# EAGLE design spi-interface-T1M (EAGLE 6.5.0)
DESIGNER: JONNEW, MWL@MIT; DESIGN_NAME: spi-interface (2x64_hirose-circular); LICENSE: (c) Jon Newman CC-BY-SA-NC 4.0; REVISION: 1.2
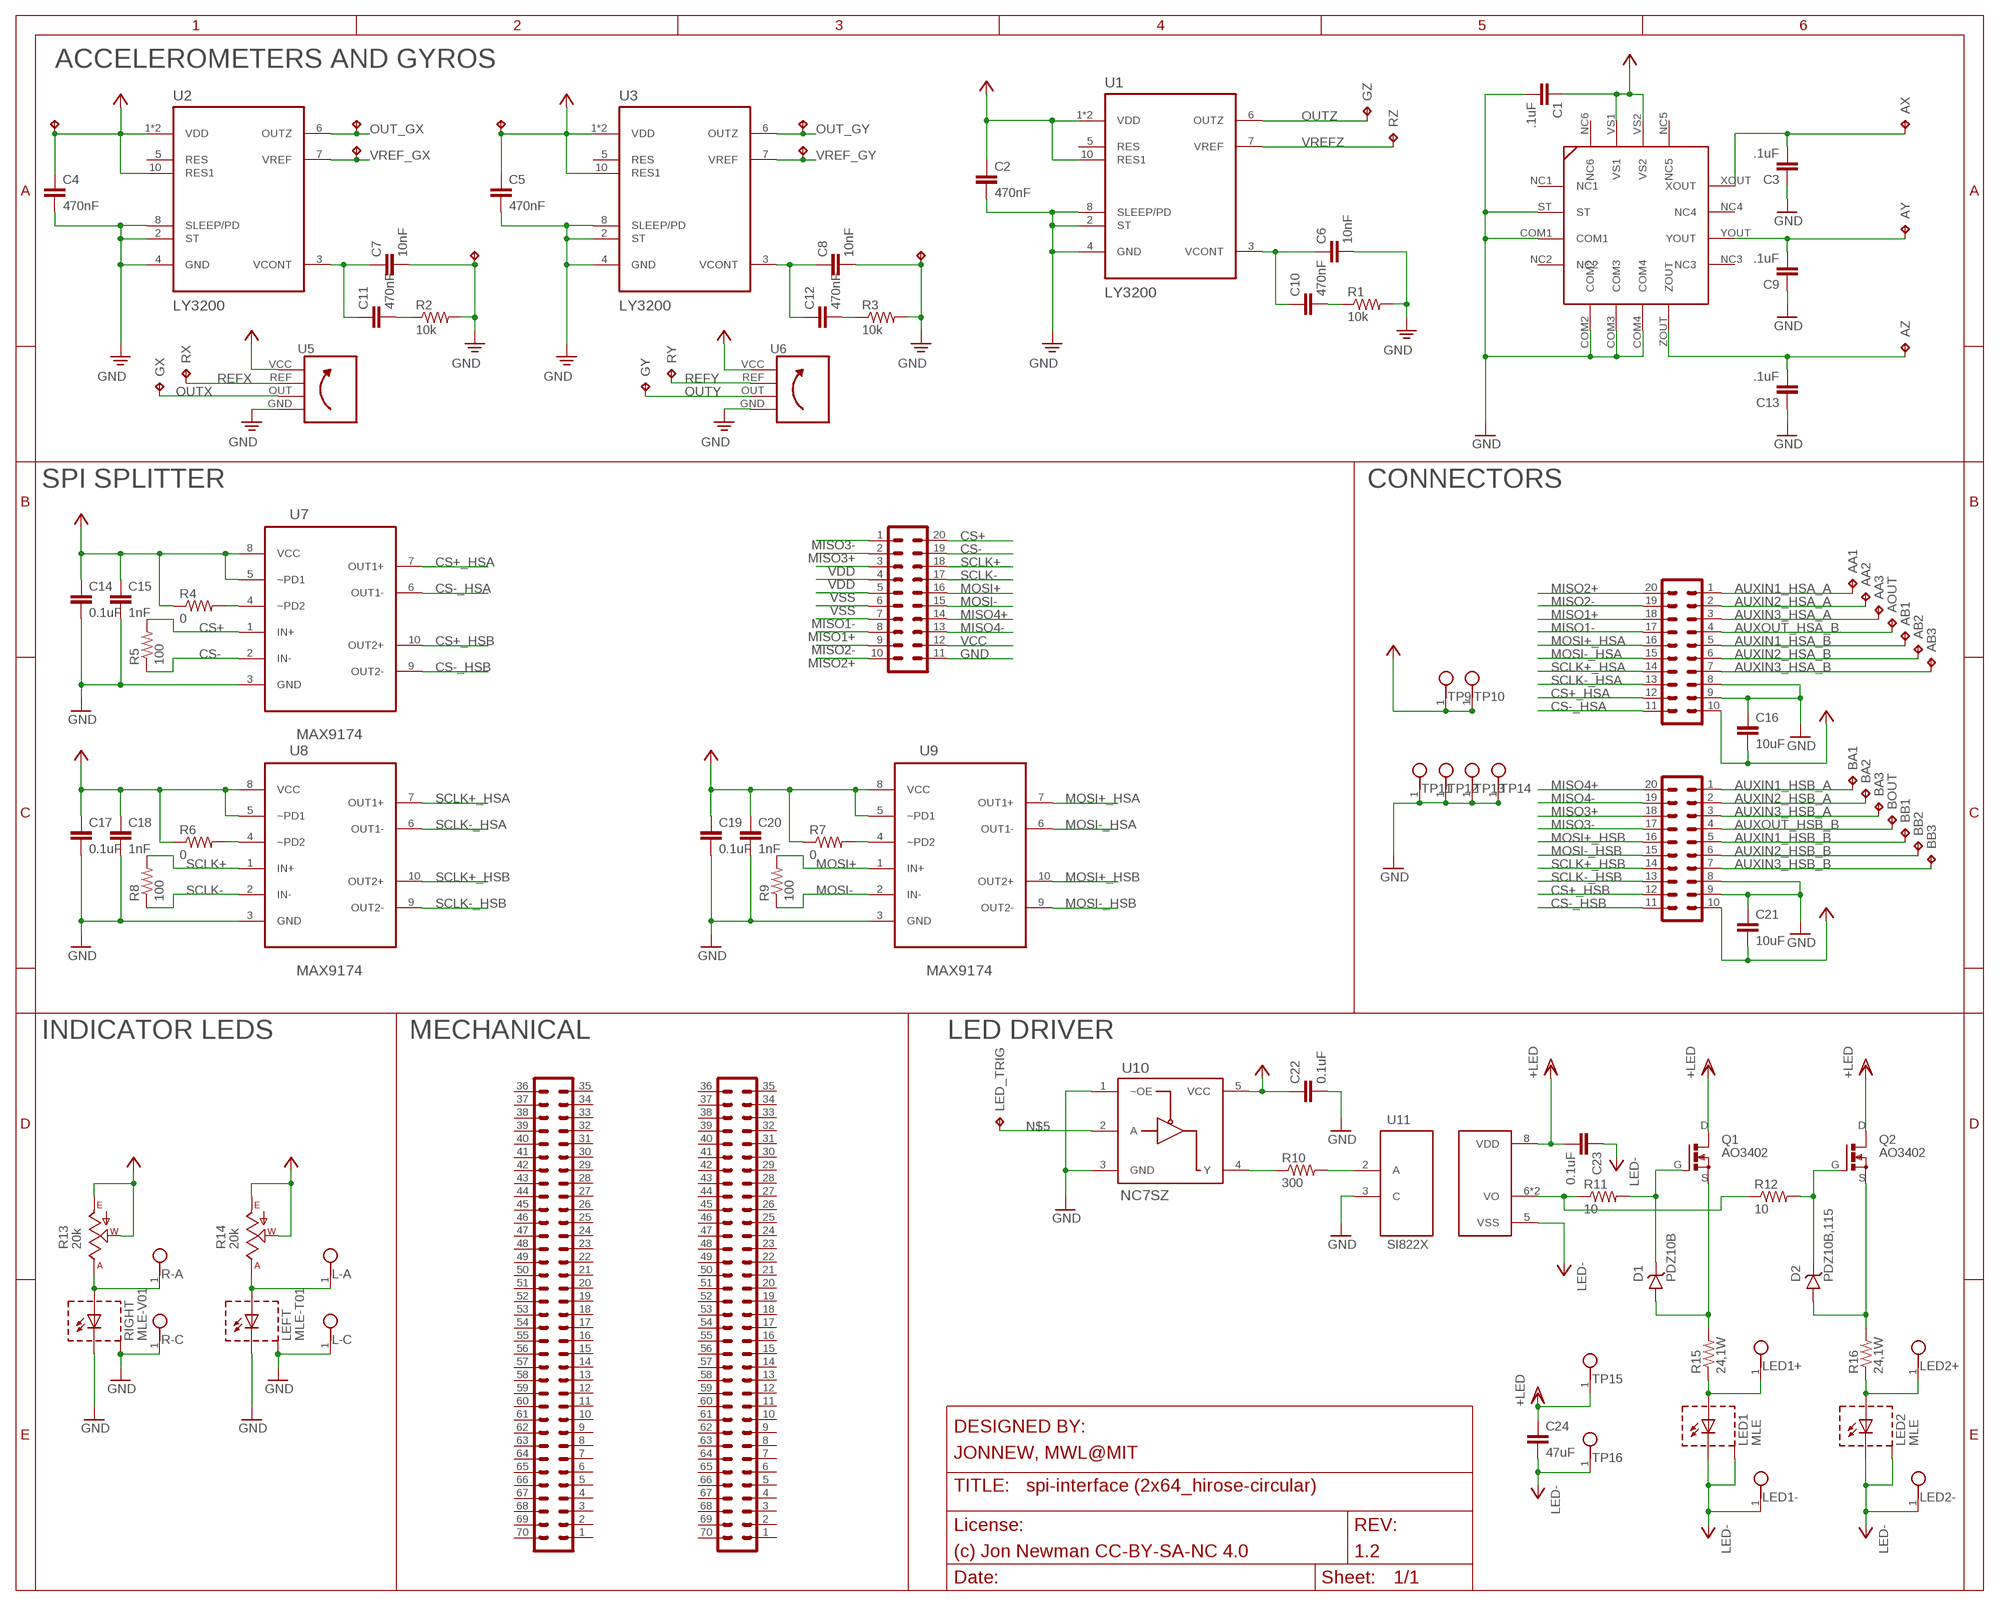
[diagram p0: schematic, sheet 1]

## Parts
AA1  TP_0.5MM  [TESTPOINT_0.5MM]
AA2  TP_0.5MM  [TESTPOINT_0.5MM]
AA3  TP_0.5MM  [TESTPOINT_0.5MM]
AB1  TP_0.5MM  [TESTPOINT_0.5MM]
AB2  TP_0.5MM  [TESTPOINT_0.5MM]
AB3  TP_0.5MM  [TESTPOINT_0.5MM]
AOUT  TP_0.5MM  [TESTPOINT_0.5MM]
AX  TP_0.5MM  [TESTPOINT_0.5MM]
AY  TP_0.5MM  [TESTPOINT_0.5MM]
AZ  TP_0.5MM  [TESTPOINT_0.5MM]
BA1  TP_0.5MM  [TESTPOINT_0.5MM]
BA2  TP_0.5MM  [TESTPOINT_0.5MM]
BA3  TP_0.5MM  [TESTPOINT_0.5MM]
BB1  TP_0.5MM  [TESTPOINT_0.5MM]
BB2  TP_0.5MM  [TESTPOINT_0.5MM]
BB3  TP_0.5MM  [TESTPOINT_0.5MM]
BOUT  TP_0.5MM  [TESTPOINT_0.5MM]
C1  .1uF  C_0402  [0402]
C2  470nF  C_0201  [0201]
C3  .1uF  C_0201  [0201]
C4  470nF  C_0201  [0201]
C5  470nF  C_0201  [0201]
C6  10nF  C_0201  [0201]
C7  10nF  C_0201  [0201]
C8  10nF  C_0201  [0201]
C9  .1uF  C_0201  [0201]
C10  470nF  C_0201  [0201]
C11  470nF  C_0201  [0201]
C12  470nF  C_0201  [0201]
C13  .1uF  C_0201  [0201]
C14  0.1uF  C_0402  [0402]
C15  1nF  C_0201  [0201]
C16  10uF  C_0805  [0805]
C17  0.1uF  C_0402  [0402]
C18  1nF  C_0201  [0201]
C19  0.1uF  C_0402  [0402]
C20  1nF  C_0201  [0201]
C21  10uF  C_0805  [0805]
C22  0.1uF  C_0402  [0402]
C23  0.1uF  C_0402  [0402]
C24  47uF  C_1206  [1206]
D1  PDZ10B  Z-DIODE_SOD-323  [SOD-323]
D2  PDZ10B,115  Z-DIODE_SOD-323  [SOD-323]
DIO_HSA  PINHD-2X10_DF40-20REC  [DF40-20REC]
DIO_HSB  PINHD-2X10_DF40-20REC  [DF40-20REC]
GX  TP_0.5MM  [TESTPOINT_0.5MM]
GY  TP_0.5MM  [TESTPOINT_0.5MM]
GZ  TP_0.5MM  [TESTPOINT_0.5MM]
L-A  TESTPOINT_SMALL  [TESTPOINT_SMALL]
L-C  TESTPOINT_SMALL  [TESTPOINT_SMALL]
LED1  MLE  LED_PKG-BODY  [LED-MLE]
LED1+  TESTPOINT_SMALL  [TESTPOINT_SMALL]
LED1-  TESTPOINT_SMALL  [TESTPOINT_SMALL]
LED2  MLE  LED_PKG-BODY  [LED-MLE]
LED2+  TESTPOINT_SMALL  [TESTPOINT_SMALL]
LED2-  TESTPOINT_SMALL  [TESTPOINT_SMALL]
LED_TRIG  TP_0.5MM  [TESTPOINT_0.5MM]
LEFT  MLE-T01  LED_PKG-BODY  [LED-MLE]
MECH_E0B  PINHD-2X35_DF40REC  [DF40-70REC]
MECH_W0B  PINHD-2X35_DF40REC  [DF40-70REC]
Q1  AO3402  N-MOSFET_SOT23-GSD  [SOT23-GSD]
Q2  AO3402  N-MOSFET_SOT23-GSD  [SOT23-GSD]
R1  10k  R_0201  [0201]
R2  10k  R_0201  [0201]
R3  10k  R_0201  [0201]
R4  0  R_0201  [0201]
R5  100  R_0201  [0201]
R6  0  R_0201  [0201]
R7  0  R_0201  [0201]
R8  100  R_0201  [0201]
R9  100  R_0201  [0201]
R10  300  R_0402  [0402]
R11  10  R_0402  [0402]
R12  10  R_0402  [0402]
R13  20k  TRIM_US-SM-42/43W  [SM-42/43W]
R14  20k  TRIM_US-SM-42/43W  [SM-42/43W]
R15  24,1W  R_0805  [0805]
R16  24,1W  R_0805  [0805]
R-A  TESTPOINT_SMALL  [TESTPOINT_SMALL]
R-C  TESTPOINT_SMALL  [TESTPOINT_SMALL]
RIGHT  MLE-V01  LED_PKG-BODY  [LED-MLE]
RX  TP_0.5MM  [TESTPOINT_0.5MM]
RY  TP_0.5MM  [TESTPOINT_0.5MM]
RZ  TP_0.5MM  [TESTPOINT_0.5MM]
TETHER  T1M-10-T-DV  PINHD-2X10_T1M  [T1M-10-T-DV]
TP1  TPTP08SQ  [TP08SQ]
TP2  TPTP08SQ  [TP08SQ]
TP3  TPTP08SQ  [TP08SQ]
TP4  TPTP08SQ  [TP08SQ]
TP5  TPTP08SQ  [TP08SQ]
TP6  TPTP08SQ  [TP08SQ]
TP7  TPTP08SQ  [TP08SQ]
TP8  TPTP08SQ  [TP08SQ]
TP9  TESTPOINT_SMALL  [TESTPOINT_SMALL]
TP10  TESTPOINT_SMALL  [TESTPOINT_SMALL]
TP11  TESTPOINT_SMALL  [TESTPOINT_SMALL]
TP12  TESTPOINT_SMALL  [TESTPOINT_SMALL]
TP13  TESTPOINT_SMALL  [TESTPOINT_SMALL]
TP14  TESTPOINT_SMALL  [TESTPOINT_SMALL]
TP15  TESTPOINT_SMALL  [TESTPOINT_SMALL]
TP16  TESTPOINT_SMALL  [TESTPOINT_SMALL]
U1  LY3200  LY3200ALH_LGA-10-COMPACT  [LGA-10-COMPACT]
U2  LY3200  LY3200ALH_LGA-10-COMPACT  [LGA-10-COMPACT]
U3  LY3200  LY3200ALH_LGA-10-COMPACT  [LGA-10-COMPACT]
U4  ADXL335  [ADXL335]
U5  LY3200-VERT-MODULE  [LY3200-VERT-MODULE]
U6  LY3200-VERT-MODULE  [LY3200-VERT-MODULE]
U7  MAX9174  MAX9174_UMAX  [10-UMAX]
U8  MAX9174  MAX9174_UMAX  [10-UMAX]
U9  MAX9174  MAX9174_UMAX  [10-UMAX]
U10  NC7SZ  NC7SZ125  [SOT-23-5]
U11  SI822X  [SOIC127P500X400-8N]

## Nets
AUXIN1_HSA_A: AA1.1(TP) DIO_HSA.1
AUXIN1_HSA_B: AB1.1(TP) DIO_HSA.5
AUXIN1_HSB_A: BA1.1(TP) DIO_HSB.1
AUXIN1_HSB_B: BB1.1(TP) DIO_HSB.5
AUXIN2_HSA_A: AA2.1(TP) DIO_HSA.2
AUXIN2_HSA_B: AB2.1(TP) DIO_HSA.6
AUXIN2_HSB_A: BA2.1(TP) DIO_HSB.2
AUXIN2_HSB_B: BB2.1(TP) DIO_HSB.6
AUXIN3_HSA_A: AA3.1(TP) DIO_HSA.3
AUXIN3_HSA_B: AB3.1(TP) DIO_HSA.7
AUXIN3_HSB_A: BA3.1(TP) DIO_HSB.3
AUXIN3_HSB_B: BB3.1(TP) DIO_HSB.7
AUXOUT_HSA_B: AOUT.1(TP) DIO_HSA.4
AUXOUT_HSB_B: BOUT.1(TP) DIO_HSB.4
CS+: R5.2 TETHER.20 U7.1(IN+)
CS+_HSA: DIO_HSA.12 U7.7(OUT1+)
CS+_HSB: DIO_HSB.12 U7.10(OUT2+)
CS-: R5.1 TETHER.19 U7.2(IN-)
CS-_HSA: DIO_HSA.11 U7.6(OUT1-)
CS-_HSB: DIO_HSB.11 U7.9(OUT2-)
GND: C1.2 C2.2 C3.1 C4.2 C5.2 C6.2 C7.2 C8.2 C9.1 C13.1 C14.2 C15.2 C16.1 C17.2 C18.2 C19.2 C20.2 C21.1 C22.2 DIO_HSA.8 DIO_HSA.9 DIO_HSB.8 DIO_HSB.9 L-C.1 LEFT.C1(C) LEFT.C2(C) LEFT.HS(BODY) R1.2 R2.2 R3.2 R-C.1 RIGHT.C1(C) RIGHT.C2(C) RIGHT.HS(BODY) TETHER.11 TP7.TP TP8.TP TP11.1 TP12.1 TP13.1 TP14.1 U1.2(ST) U1.4(GND) U1.8(SLEEP/PD) U2.2(ST) U2.4(GND) U2.8(SLEEP/PD) U3.2(ST) U3.4(GND) U3.8(SLEEP/PD) U4.COM1 U4.COM2 U4.COM3 U4.COM4 U4.ST U5.GND U6.GND U7.3(GND) U8.3(GND) U9.3(GND) U10.1(~OE) U10.3(GND) U11.3(C)
MISO1+: DIO_HSA.18 TETHER.8
MISO1-: DIO_HSA.17 TETHER.7
MISO2+: DIO_HSA.20 TETHER.10
MISO2-: DIO_HSA.19 TETHER.9
MISO3+: DIO_HSB.18 TETHER.2
MISO3-: DIO_HSB.17 TETHER.1
MISO4+: DIO_HSB.20 TETHER.14
MISO4-: DIO_HSB.19 TETHER.13
MOSI+: R9.2 TETHER.16 U9.1(IN+)
MOSI+_HSA: DIO_HSA.16 U9.7(OUT1+)
MOSI+_HSB: DIO_HSB.16 U9.10(OUT2+)
MOSI-: R9.1 TETHER.15 U9.2(IN-)
MOSI-_HSA: DIO_HSA.15 U9.6(OUT1-)
MOSI-_HSB: DIO_HSB.15 U9.9(OUT2-)
N$1: R10.2 U11.2(A)
N$2: C7.1 C11.1 U2.3(VCONT)
N$3: LED1+.1 LED1.A1(A) LED1.A2(A) R15.1
N$4: D1.A Q1.S R15.2
N$5: LED_TRIG.1(TP) U10.2(A)
N$6: R10.1 U10.4(Y)
N$7: D2.C Q2.G R12.2
N$8: C11.2 R2.1
N$9: R13.1(A) R-A.1 RIGHT.A1(A) RIGHT.A2(A)
N$10: C8.1 C12.1 U3.3(VCONT)
N$11: D2.A Q2.S R16.2
N$12: LED2+.1 LED2.A1(A) LED2.A2(A) R16.1
N$13: L-A.1 LEFT.A1(A) LEFT.A2(A) R14.1(A)
N$14: C12.2 R3.1
N$15: C6.1 C10.1 U1.3(VCONT)
N$16: C10.2 R1.1
N$17: R4.2 U7.4(~PD2)
N$18: R7.2 U9.4(~PD2)
N$19: R6.2 U8.4(~PD2)
N$20: D1.C Q1.G R11.2
N$22: R11.1 R12.1 U11.6(VO) U11.7(VO)
OUT_GX: TP2.TP U2.6(OUTZ)
OUT_GY: TP4.TP U3.6(OUTZ)
OUTX: GX.1(TP) U5.OUT
OUTY: GY.1(TP) U6.OUT
OUTZ: GZ.1(TP) U1.6(OUTZ)
REFX: RX.1(TP) U5.REF
REFY: RY.1(TP) U6.REF
SCLK+: R8.2 TETHER.18 U8.1(IN+)
SCLK+_HSA: DIO_HSA.14 U8.7(OUT1+)
SCLK+_HSB: DIO_HSB.14 U8.10(OUT2+)
SCLK-: R8.1 TETHER.17 U8.2(IN-)
SCLK-_HSA: DIO_HSA.13 U8.6(OUT1-)
SCLK-_HSB: DIO_HSB.13 U8.9(OUT2-)
VCC: C1.1 C2.1 C4.1 C5.1 C14.1 C15.1 C16.2 C17.1 C18.1 C19.1 C20.1 C21.2 C22.1 DIO_HSA.10 DIO_HSB.10 R4.1 R6.1 R7.1 R13.2(W) R13.3(E) R14.2(W) R14.3(E) TETHER.12 TP1.TP TP3.TP TP9.1 TP10.1 U1.1(VDD) U1.9(VDD) U1.10(RES1) U2.1(VDD) U2.9(VDD) U2.10(RES1) U3.1(VDD) U3.9(VDD) U3.10(RES1) U4.VS1 U4.VS2 U5.VCC U6.VCC U7.5(~PD1) U7.8(VCC) U8.5(~PD1) U8.8(VCC) U9.5(~PD1) U9.8(VCC) U10.5(VCC)
VDD: C23.2 C24.1 Q1.D Q2.D TETHER.3 TETHER.4 TP15.1 U11.8(VDD) ; supply symbol labelled +LED
VREF_GX: TP5.TP U2.7(VREF)
VREF_GY: TP6.TP U3.7(VREF)
VREFZ: RZ.1(TP) U1.7(VREF)
VSS: C23.1 C24.2 LED1-.1 LED1.C1(C) LED1.C2(C) LED1.HS(BODY) LED2-.1 LED2.C1(C) LED2.C2(C) LED2.HS(BODY) TETHER.5 TETHER.6 TP16.1 U11.5(VSS) ; supply symbol labelled LED-
XOUT1: AX.1(TP) C3.2 U4.XOUT
YOUT1: AY.1(TP) C9.2 U4.YOUT
ZOUT1: AZ.1(TP) C13.2 U4.ZOUT
Unconnected: MECH_E0B.1 MECH_E0B.2 MECH_E0B.3 MECH_E0B.4 MECH_E0B.5 MECH_E0B.6 MECH_E0B.7 MECH_E0B.8 MECH_E0B.9 MECH_E0B.10 MECH_E0B.11 MECH_E0B.12 MECH_E0B.13 MECH_E0B.14 MECH_E0B.15 MECH_E0B.16 MECH_E0B.17 MECH_E0B.18 MECH_E0B.19 MECH_E0B.20 MECH_E0B.21 MECH_E0B.22 MECH_E0B.23 MECH_E0B.24 MECH_E0B.25 MECH_E0B.26 MECH_E0B.27 MECH_E0B.28 MECH_E0B.29 MECH_E0B.30 MECH_E0B.31 MECH_E0B.32 MECH_E0B.33 MECH_E0B.34 MECH_E0B.35 MECH_E0B.36 MECH_E0B.37 MECH_E0B.38 MECH_E0B.39 MECH_E0B.40 MECH_E0B.41 MECH_E0B.42 MECH_E0B.43 MECH_E0B.44 MECH_E0B.45 MECH_E0B.46 MECH_E0B.47 MECH_E0B.48 MECH_E0B.49 MECH_E0B.50 MECH_E0B.51 MECH_E0B.52 MECH_E0B.53 MECH_E0B.54 MECH_E0B.55 MECH_E0B.56 MECH_E0B.57 MECH_E0B.58 MECH_E0B.59 MECH_E0B.60 MECH_E0B.61 MECH_E0B.62 MECH_E0B.63 MECH_E0B.64 MECH_E0B.65 MECH_E0B.66 MECH_E0B.67 MECH_E0B.68 MECH_E0B.69 MECH_E0B.70 MECH_W0B.1 MECH_W0B.2 MECH_W0B.3 MECH_W0B.4 MECH_W0B.5 MECH_W0B.6 MECH_W0B.7 MECH_W0B.8 MECH_W0B.9 MECH_W0B.10 MECH_W0B.11 MECH_W0B.12 MECH_W0B.13 MECH_W0B.14 MECH_W0B.15 MECH_W0B.16 MECH_W0B.17 MECH_W0B.18 MECH_W0B.19 MECH_W0B.20 MECH_W0B.21 MECH_W0B.22 MECH_W0B.23 MECH_W0B.24 MECH_W0B.25 MECH_W0B.26 MECH_W0B.27 MECH_W0B.28 MECH_W0B.29 MECH_W0B.30 MECH_W0B.31 MECH_W0B.32 MECH_W0B.33 MECH_W0B.34 MECH_W0B.35 MECH_W0B.36 MECH_W0B.37 MECH_W0B.38 MECH_W0B.39 MECH_W0B.40 MECH_W0B.41 MECH_W0B.42 MECH_W0B.43 MECH_W0B.44 MECH_W0B.45 MECH_W0B.46 MECH_W0B.47 MECH_W0B.48 MECH_W0B.49 MECH_W0B.50 MECH_W0B.51 MECH_W0B.52 MECH_W0B.53 MECH_W0B.54 MECH_W0B.55 MECH_W0B.56 MECH_W0B.57 MECH_W0B.58 MECH_W0B.59 MECH_W0B.60 MECH_W0B.61 MECH_W0B.62 MECH_W0B.63 MECH_W0B.64 MECH_W0B.65 MECH_W0B.66 MECH_W0B.67 MECH_W0B.68 MECH_W0B.69 MECH_W0B.70 U1.5(RES) U2.5(RES) U3.5(RES) U4.NC1 U4.NC2 U4.NC3 U4.NC4 U4.NC5 U4.NC6

## Notes on the sheet
- ACCELEROMETERS AND GYROS
- SPI SPLITTER | CONNECTORS
- INDICATOR LEDS | MECHANICAL | LED DRIVER

## Library data of the parts
AA1-AA3 AB1-AB3 AOUT AX AY AZ BA1-BA3 BB1-BB3 BOUT GX GY GZ LED_TRIG RX RY RZ TP1-TP8 = jonnew:TP: Test pad
C1 = headstage:C: Capacitor
C2-C15 C17-C20 C22-C24 = jonnew:C: Capacitor
C16 C21 = headstage:C: Capacitor; MN: TDK Corp.; PARTNO: C2012X5R1Cxxxxxxx; VID: DK
D1 D2 = jonnew:Z-DIODE: Zener Diode
DIO_HSA DIO_HSB TETHER = jonnew:PINHD-2X10
L-A L-C LED1+ LED1- LED2+ LED2- R-A R-C TP9-TP16 = jonnew:TESTPOINT: PCB Test Point
LED1 LED2 LEFT RIGHT = jonnew:LED_PKG-BODY
MECH_E0B MECH_W0B = jonnew:PINHD-2X35
Q1 Q2 = jonnew:N-MOSFET: N-CHANNEL MOS FET SYMBOL
R1-R12 R15 R16 = jonnew:R: Resistor
R13 R14 = jonnew:TRIM_US-: POTENTIOMETER
U1-U3 = jonnew:LY3200ALH
U4 = jonnew:ADXL335: The ADXL335 is a small, thin, low power, complete 3-axis accelerometer with signal conditioned voltage outputs. The product measures acceleration with a minimum full-scale range of ±3 g. It can measure the static acceleration of gravity in tilt-sensing applications, as well as dynamic acceleration resulting from motion, shock, or vibration. The user selects the bandwidth of the accelerometer using the CX, CY, and CZ capacitors at the XOUT, YOUT, and ZOUT pins. Bandwidths can be selected to suit the application, with a range of 0.5 Hz to 1600 Hz for the X and Y axes, and a range of 0.5 Hz to 550 Hz for the Z axi
U5 U6 = jonnew:LY3200-VERT-MODULE
U7-U9 = jonnew:MAX9174
U10 = jonnew:NC7SZ125
U11 = jonnew:SI822X

## Net classes
1 thick: width 0.102 mm

## Board
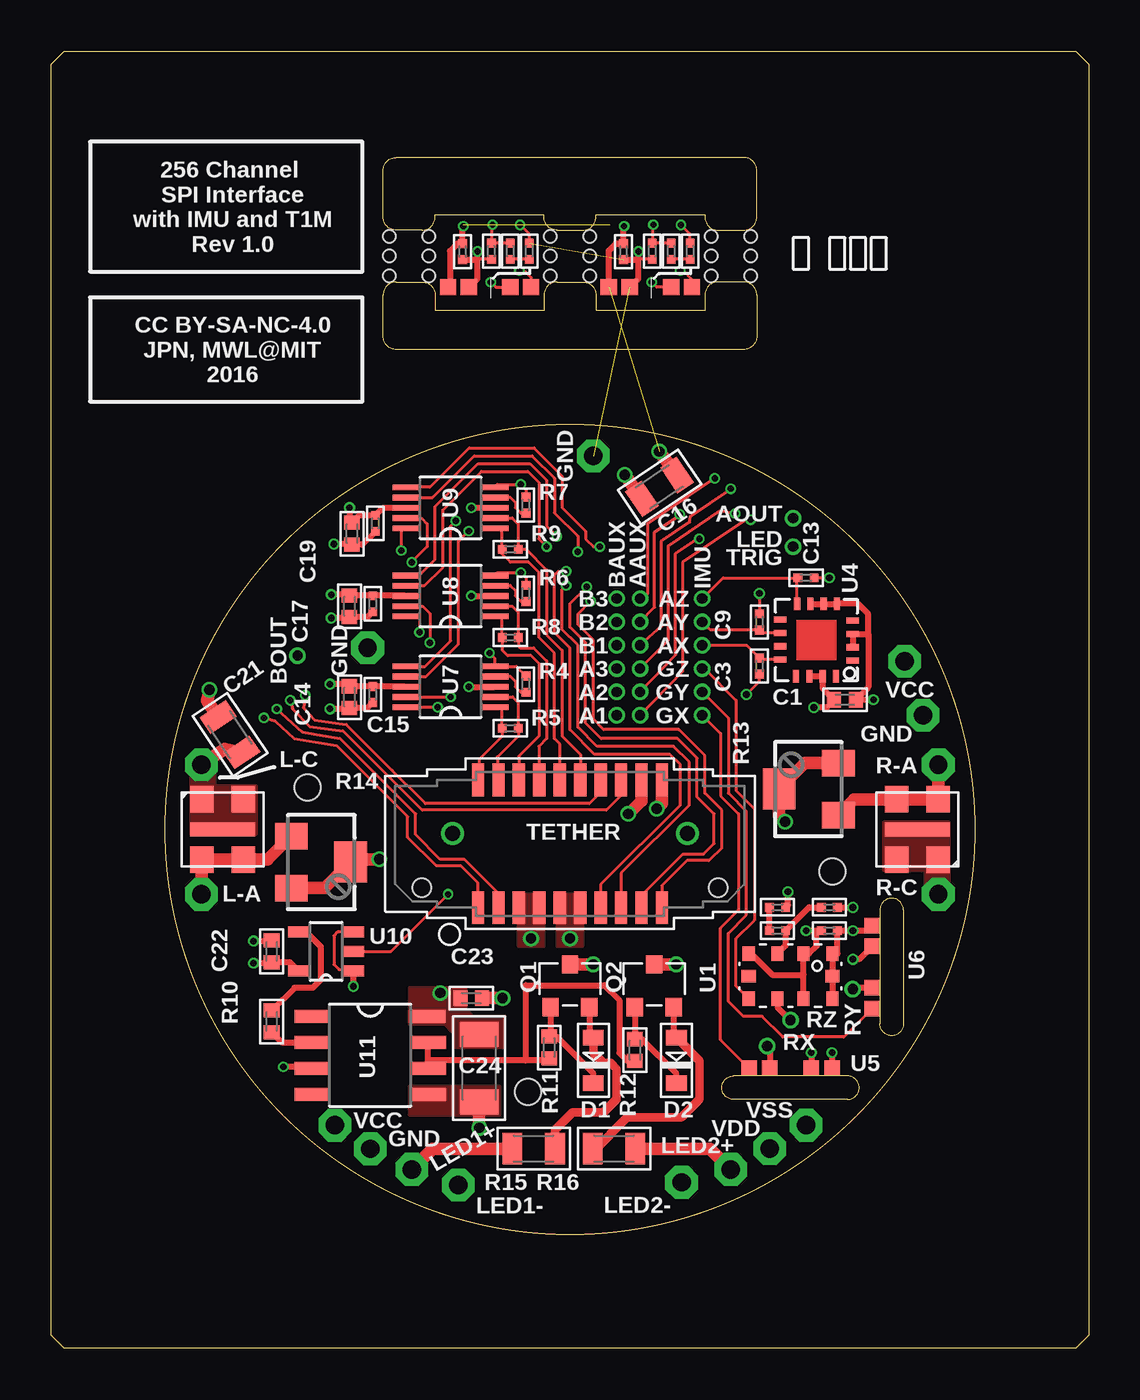
[diagram p1: board, top side]
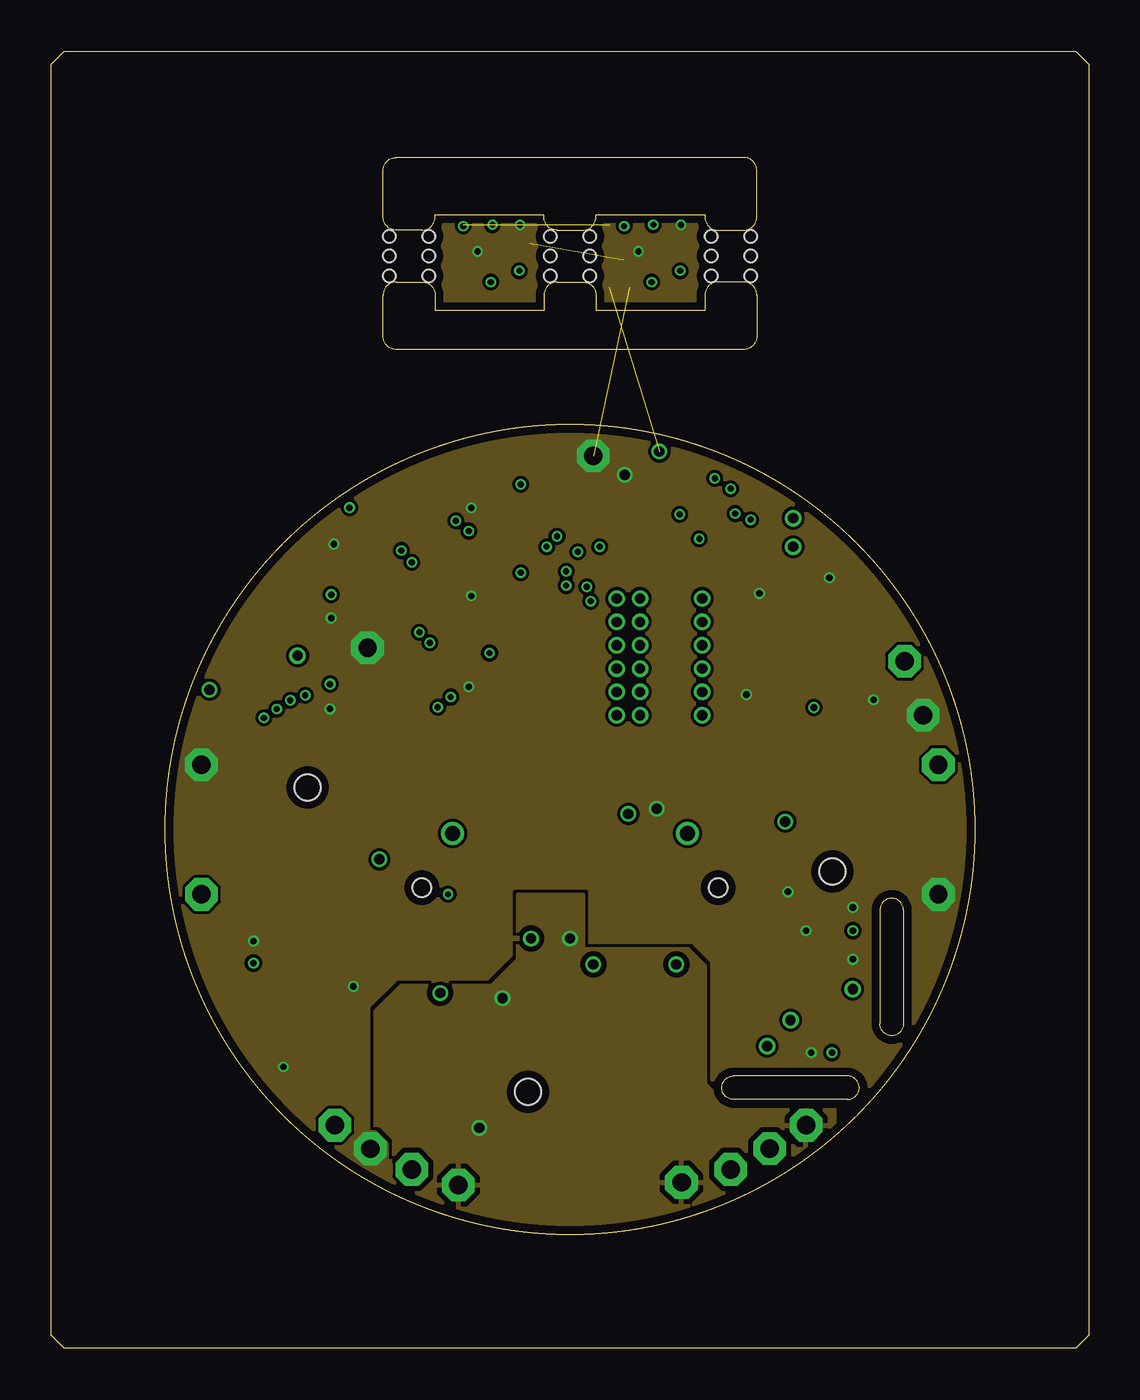
[diagram p2: board, inner layer Route2]
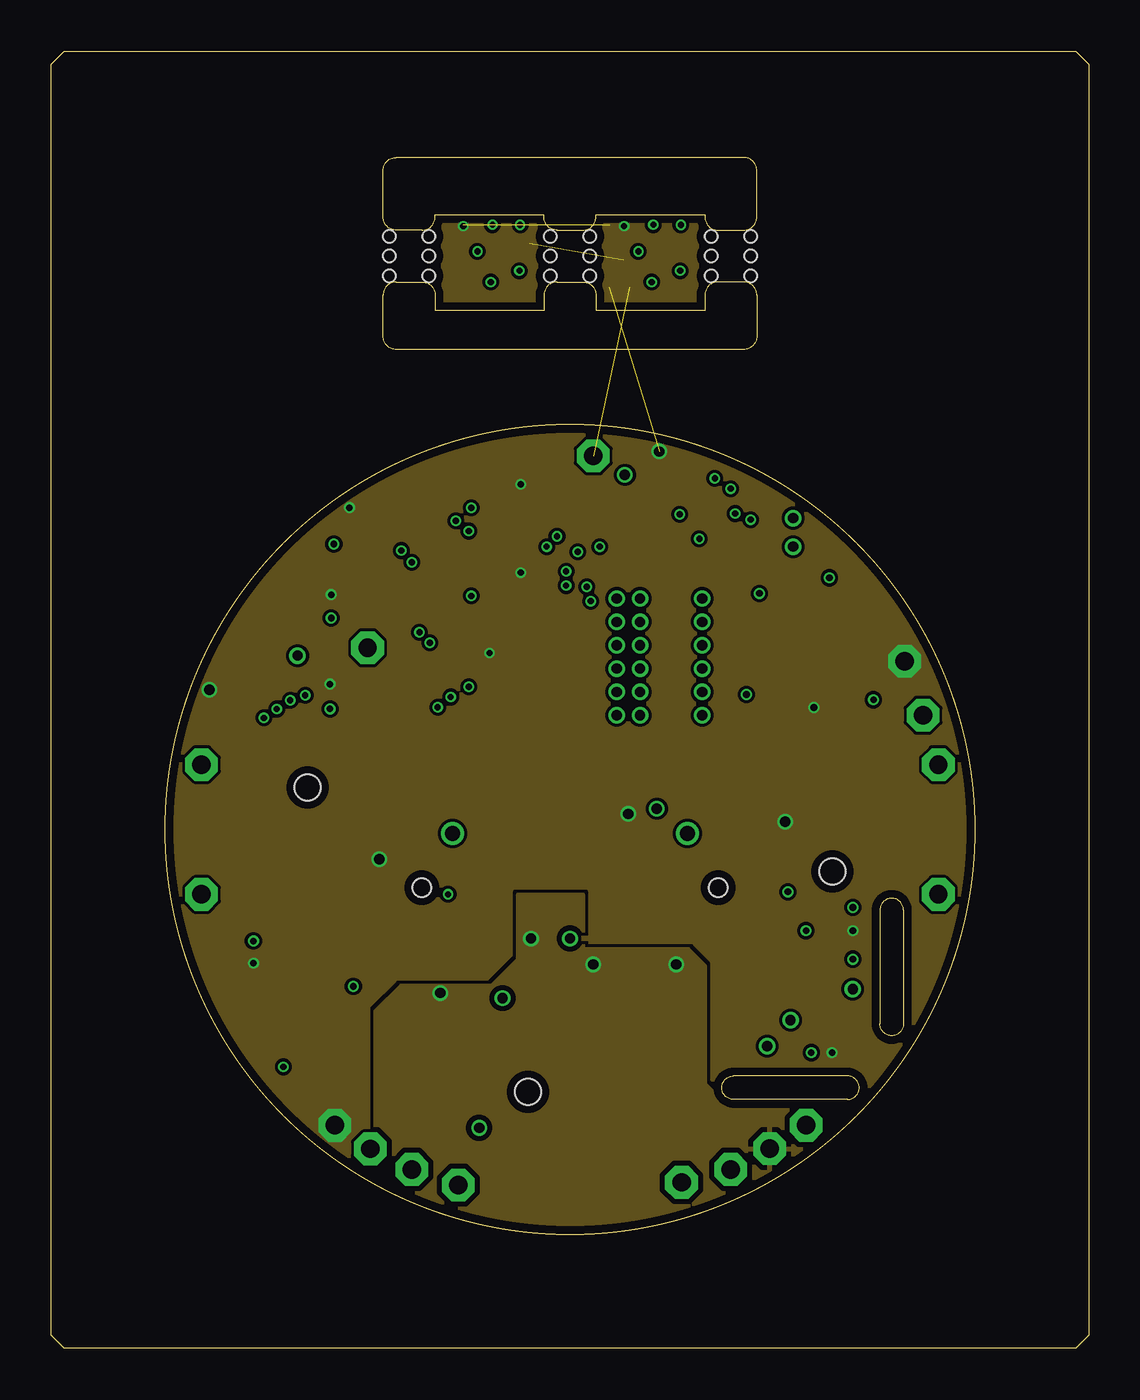
[diagram p3: board, inner layer Route15]
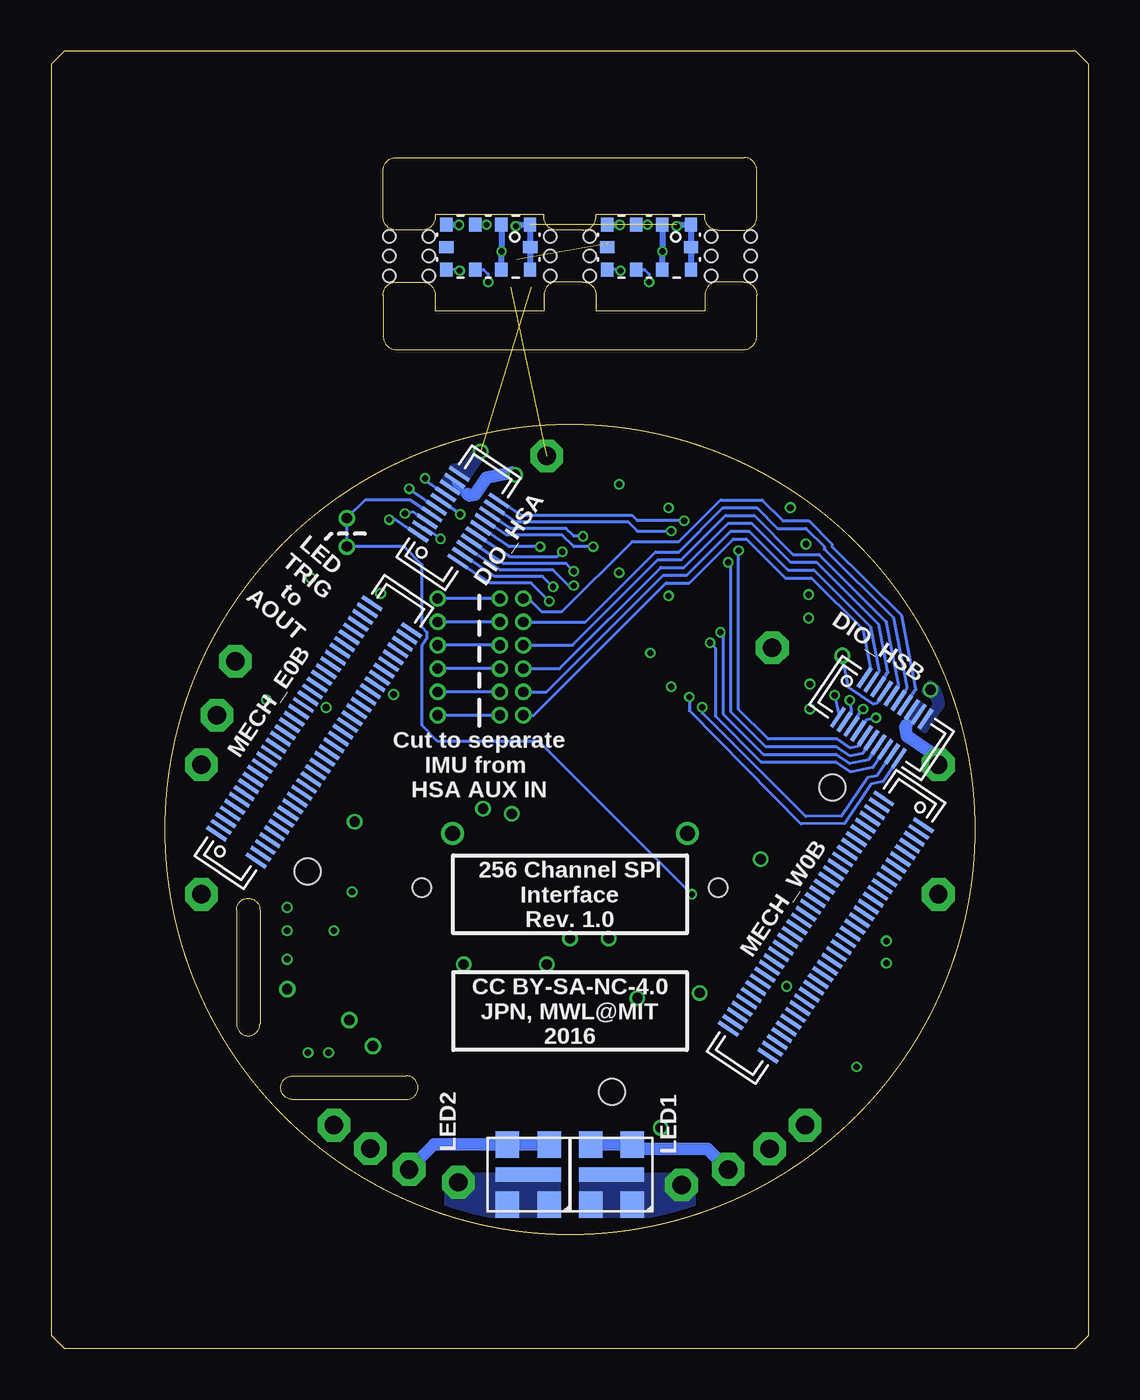
[diagram p4: board, bottom side, seen from below]

Size 50.8 x 63.5 mm. Coordinates in mm from the lower left corner, seen from the top.
Outline: 16.89,52.2 18.16,52.2 arc-90 18.8,51.56 18.8,50.8 24.13,50.8 24.13,51.56 arc-90 24.76,52.2 26.04,52.2 arc-90 26.67,51.56 26.67,50.8 32,50.8 32,51.56 arc-90 32.64,52.2 33.91,52.2 arc-90 34.54,51.56 34.54,49.53 arc-90 33.91,48.89 16.89,48.89 arc-90 16.26,49.53 16.26,51.56 arc-90 16.89,52.2
Outline: 18.16,54.74 16.89,54.74 arc-90 16.26,55.37 16.26,57.66 arc-90 16.89,58.29 33.91,58.29 arc-90 34.54,57.66 34.54,55.37 arc-90 33.91,54.74 32.64,54.74 arc-90 32,55.37 32,55.5 26.67,55.5 26.67,55.37 arc-90 26.04,54.74 24.76,54.74 arc-90 24.13,55.37 24.13,55.5 18.8,55.5 18.8,55.37 arc-90 18.16,54.74
Outline: 50.16,0 0.63,0 0,0.63 0,62.87 0.63,63.5 50.16,63.5 50.8,62.87 50.8,0.63 50.16,0
Outline: circle at 25.4,25.4 radius 19.81
Copper layers (1*2*15*16): Top 0.035mm / dielectric 0.2mm / Route2 0.0175mm / dielectric 0.3mm / Route15 0.0175mm / dielectric 0.2mm / Bottom 0.035mm
Design rules "seeed-studio-4-layer": minimum track width 6mil, minimum drill 0.3mm, track to track 6mil, track to pad 6mil, pad to pad 6mil, via to via 6mil, smd to smd 0mil, copper to edge 0.4mm, drill to drill 10mil, minimum pad ring 6mil, minimum via ring 4mil, stop-mask expansion 4mil, vias tented up to drill 100mil, thermal gap 10mil
Holes 1.27 mm at 38.25,23.34 23.34,12.55 12.55,27.46
Holes 0.6 mm at 18.49,54.43 18.49,53.47 18.49,52.5 16.56,54.43 16.56,53.47 16.56,52.5 26.37,54.43 26.37,53.47 26.37,52.5 24.43,54.43 24.43,53.47 24.43,52.5 34.24,54.43 34.24,53.47 34.24,52.5 32.31,54.43 32.31,53.47 32.31,52.5

### Footprints (pad centres in the part's own frame; a part is rotated, then mirrored left to right if it is on the bottom)
TESTPOINT_0.5MM = drill 0.5: 1 0,0
0402 = smd 0.686 x 0.762: 1 -0.533,0; 2 0.533,0
0201 = smd 0.432 x 0.432: 1 -0.394,0; 2 0.394,0
0805 = smd 0.965 x 1.524: 1 -1.041,0; 2 1.041,0
1206 = smd 1.219 x 1.88: 1 -1.651,0; 2 1.651,0
SOD-323 = smd 0.762 x 1.016: A -1.118,0; C 1.118,0
DF40-20REC = smd 0.2 x 1.14: 1 -1.8,1.17; 2 -1.4,1.17; 3 -1,1.17; 4 -0.6,1.17; 5 -0.2,1.17; 6 0.2,1.17; 7 0.6,1.17; 8 1,1.17; 9 1.4,1.17; 10 1.8,1.17; 11 1.8,-1.17; 12 1.4,-1.17; 13 1,-1.17; 14 0.6,-1.17; 15 0.2,-1.17; 16 -0.2,-1.17; 17 -0.6,-1.17; 18 -1,-1.17; 19 -1.4,-1.17; 20 -1.8,-1.17
TESTPOINT_SMALL = drill 0.9 pad 1.6 octagon: 1 0,0
LED-MLE = smd 1.3 x 1.15: A1 -1.475,1.025; A2 -1.475,-1.025; C1 1.475,1.025; C2 1.475,-1.025 | smd 0.7 x 3.2: HS 0,0
DF40-70REC = smd 0.2 x 1.14: 1 -6.8,1.17; 2 -6.4,1.17; 3 -6,1.17; 4 -5.6,1.17; 5 -5.2,1.17; 6 -4.8,1.17; 7 -4.4,1.17; 8 -4,1.17; 9 -3.6,1.17; 10 -3.2,1.17; 11 -2.8,1.17; 12 -2.4,1.17; 13 -2,1.17; 14 -1.6,1.17; 15 -1.2,1.17; 16 -0.8,1.17; 17 -0.4,1.17; 18 0,1.17; 19 0.4,1.17; 20 0.8,1.17; 21 1.2,1.17; 22 1.6,1.17; 23 2,1.17; 24 2.4,1.17; 25 2.8,1.17; 26 3.2,1.17; 27 3.6,1.17; 28 4,1.17; 29 4.4,1.17; 30 4.8,1.17; 31 5.2,1.17; 32 5.6,1.17; 33 6,1.17; 34 6.4,1.17; 35 6.8,1.17; 36 6.8,-1.17; 37 6.4,-1.17; 38 6,-1.17; 39 5.6,-1.17; 40 5.2,-1.17; 41 4.8,-1.17; 42 4.4,-1.17; 43 4,-1.17; 44 3.6,-1.17; 45 3.2,-1.17; 46 2.8,-1.17; 47 2.4,-1.17; 48 2,-1.17; 49 1.6,-1.17; 50 1.2,-1.17; 51 0.8,-1.17; 52 0.4,-1.17; 53 0,-1.17; 54 -0.4,-1.17; 55 -0.8,-1.17; 56 -1.2,-1.17; 57 -1.6,-1.17; 58 -2,-1.17; 59 -2.4,-1.17; 60 -2.8,-1.17; 61 -3.2,-1.17; 62 -3.6,-1.17; 63 -4,-1.17; 64 -4.4,-1.17; 65 -4.8,-1.17; 66 -5.2,-1.17; 67 -5.6,-1.17; 68 -6,-1.17; 69 -6.4,-1.17; 70 -6.8,-1.17
SOT23-GSD = smd 0.8 x 0.9: D 0,0; G -0.95,-2.1; S 0.95,-2.1
SM-42/43W = smd 1.3 x 1.6: 1 -1.27,-1.45; 3 1.27,-1.45 | smd 2 x 1.6: 2 0,1.45
T1M-10-T-DV = smd 0.6 x 1.6: 1 -4.5,-4.395; 2 -3.5,-4.395; 3 -2.5,-4.395; 4 -1.5,-4.395; 5 -0.5,-4.395; 6 0.5,-4.395; 7 1.5,-4.395; 8 2.5,-4.395; 9 3.5,-4.395; 10 4.5,-4.395; 11 4.5,1.855; 12 3.5,1.855; 13 2.5,1.855; 14 1.5,1.855; 15 0.5,1.855; 16 -0.5,1.855; 17 -1.5,1.855; 18 -2.5,1.855; 19 -3.5,1.855; 20 -4.5,1.855 | drill 0.74: G1 -5.75,-0.77; G2 5.75,-0.77 | hole 0.89: -7.25,-3.42; 7.25,-3.42
TP08SQ = smd 0.8 x 0.8: TP 0,0
LGA-10-COMPACT = smd 0.6 x 0.7: 1 2.05,1.1; 2 0.635,1.1; 3 -0.635,1.1; 4 -2.05,1.1; 6 -2.05,-1.1; 7 -0.635,-1.1; 8 0.635,-1.1; 9 2.05,-1.1 | smd 0.7 x 0.6: 5 -2.05,0; 10 2.05,0
ADXL335 = smd 0.61 x 0.305: COM1 -1.775,-0.3; NC1 -1.775,1; NC2 -1.775,-0.95; NC3 1.775,-1; NC4 1.775,0.3; ST -1.775,0.35; XOUT 1.775,0.95; YOUT 1.775,-0.35 | smd 0.305 x 0.61: COM2 -1,-1.775; COM3 -0.35,-1.775; COM4 0.3,-1.775; NC5 1,1.775; NC6 -0.95,1.775; VS1 0.35,1.775; VS2 -0.3,1.775; ZOUT 0.95,-1.775
LY3200-VERT-MODULE = smd 0.762 x 0.762: GND 0.381,-1.016; OUT 0.381,2.032; REF 0.381,1.016; VCC 0.381,-2.032
10-UMAX = smd 1.4 x 0.28: 1 -2.14,1; 2 -2.14,0.5; 3 -2.14,0; 4 -2.14,-0.5; 5 -2.14,-1; 6 2.14,-1; 7 2.14,-0.5; 8 2.14,0; 9 2.14,0.5; 10 2.14,1
SOT-23-5 = smd 0.55 x 1: 1 -0.95,-1.35; 2 0,-1.35; 3 0.95,-1.35; 4 0.95,1.35; 5 -0.95,1.35
SOIC127P500X400-8N = smd 1.778 x 0.635: 1 -2.819,1.905; 2 -2.819,0.635; 3 -2.819,-0.635; 4 -2.819,-1.905; 5 2.819,-1.905; 6 2.819,-0.635; 7 2.819,0.635; 8 2.794,1.905

### Placement (x,y rotation side)
AA1  28.83,30.99 0 top
AA2  28.83,32.13 0 top
AA3  28.83,33.27 0 top
AB1  28.83,34.42 0 top
AB2  28.83,35.56 0 top
AB3  28.83,36.7 0 top
AOUT  36.32,40.64 0 top
AX  31.88,34.42 0 top
AY  31.88,35.56 0 top
AZ  31.88,36.7 0 top
BA1  27.69,30.99 270 top
BA2  27.69,32.13 270 top
BA3  27.69,33.27 270 top
BB1  27.69,34.42 270 top
BB2  27.69,35.56 270 top
BB3  27.69,36.7 270 top
BOUT  12.07,33.91 270 top
C1  38.86,31.75 0 top
C2  38.1,20.45 180 top
C3  34.67,33.4 90 top
C4  20.14,53.68 270 top
C5  28.02,53.68 270 top
C6  38.1,21.59 0 top
C7  21.55,53.7 270 top
C8  29.43,53.7 270 top
C9  34.67,35.56 270 top
C10  35.56,20.45 180 top
C11  22.48,53.7 270 top
C12  30.36,53.7 270 top
C13  36.96,37.72 180 top
C14  14.61,31.88 270 top
C15  15.75,32 270 top
C16  29.78,42.16 34 top
C17  14.61,36.32 270 top
C18  15.75,36.45 270 top
C19  14.73,39.88 270 top
C20  15.88,40.39 270 top
C21  8.76,30.04 124 top
C22  10.8,19.43 90 top
C23  20.57,17.15 180 top
C24  20.96,13.72 270 top
D1  26.54,14.1 270 top
D2  30.61,14.1 270 top
DIO_HSA  30.85,40.66 56 bottom
DIO_HSB  10.14,30.85 326 bottom
GX  31.88,30.99 0 top
GY  31.88,32.13 0 top
GZ  31.88,33.27 0 top
L-A  7.37,22.22 0 top
L-C  7.37,28.57 0 top
LED1  23.37,8.51 270 bottom
LED1+  17.65,8.76 180 top
LED1-  19.94,8 180 top
LED2  27.43,8.51 270 bottom
LED2+  33.27,8.76 180 top
LED2-  30.86,8.13 180 top
LED_TRIG  36.32,39.24 0 top
LEFT  8.4,25.4 90 top
MECH_E0B  37.93,30.17 56 bottom
MECH_W0B  12.87,20.63 236 bottom
Q1  25.4,18.8 0 top
Q2  29.53,18.8 0 top
R1  35.56,21.59 0 top
R2  23.41,53.7 90 top
R3  31.28,53.7 90 top
R4  23.24,32.51 270 top
R5  22.48,30.35 180 top
R6  23.24,36.96 270 top
R7  23.24,41.27 270 top
R8  22.48,34.8 180 top
R9  22.48,39.12 180 top
R10  10.8,16 270 top
R11  24.38,14.73 90 top
R12  28.57,14.61 90 top
R13  37.08,27.38 90 top
R14  13.21,23.8 270 top
R15  23.62,9.78 0 top
R16  27.56,9.78 180 top
R-A  43.43,28.57 0 top
R-C  43.43,22.23 0 top
RIGHT  42.4,25.4 270 top
RX  35.05,14.8 0 top
RY  39.24,17.59 0 top
RZ  36.19,16.07 0 top
TETHER  25.4,25.97 0 top
TP1  19.43,51.94 0 top
TP2  23.5,51.94 0 top
TP3  27.3,51.94 0 top
TP4  31.37,51.94 0 top
TP5  22.48,51.94 0 top
TP6  30.35,51.94 0 top
TP7  20.45,51.94 0 top
TP8  28.32,51.94 0 top
TP9  13.89,10.92 0 top
TP10  41.78,33.64 0 top
TP11  15.62,9.77 0 top
TP12  42.68,30.99 0 top
TP13  26.54,43.69 0 top
TP14  15.49,34.29 0 top
TP15  35.18,9.78 0 top
TP16  36.96,10.92 0 top
U1  36.19,18.22 0 top
U2  21.53,53.9 0 bottom
U3  29.4,53.9 0 bottom
U4  37.46,34.67 180 top
U5  36.19,13.34 90 top
U6  40.58,18.67 180 top
U7  19.56,32.38 180 top
U8  19.56,36.83 180 top
U9  19.56,41.15 180 top
U10  13.46,19.43 90 top
U11  15.62,14.35 0 top

### Tracks (layer width: path | path; a pad name or v marks a point on that pad's centre or on a via)
AUXIN1_HSA_A  (via drill 0.3)
  Top 0.152: AA1.1 30.92,33.15 30.92,38.48 34.07,40.6 v34.25,40.56
  Bottom 0.152: DIO_HSA.1 34,40.61 v34.25,40.56
AUXIN1_HSA_B  (via drill 0.3)
  Top 0.152: AB1.1 29.89,35.35 29.89,39.53 31.25,40.45 31.3,40.72 33.26,42.04 v33.27,42.08
  Bottom 0.152: DIO_HSA.5 33.09,41.93 33.26,42.04 v33.27,42.08
AUXIN1_HSB_A
  Bottom 0.152: BA1.1 27.18,30.99 20.7,37.46 19.56,37.46 17.4,39.62 16.76,39.62 14.86,37.72 13.59,37.72 11.05,35.18 10.68,33.27 DIO_HSB.1
AUXIN1_HSB_B
  Bottom 0.152: BB1.1 25.27,34.42 21.08,38.61 19.94,38.61 17.78,40.77 16.38,40.77 14.48,38.86 13.21,38.86 9.91,35.56 9.3,32.45 DIO_HSB.5
AUXIN2_HSA_A  (via drill 0.3)
  Top 0.152: AA2.1 30.57,33.94 30.57,38.91 31.66,39.64 v31.73,39.63
  Bottom 0.152: DIO_HSA.2 32.53,40.17 v31.73,39.63
AUXIN2_HSA_B  (via drill 0.3)
  Top 0.152: AB2.1 29.55,36.28 29.55,39.95 30.77,40.77 v30.78,40.82
  Bottom 0.152: DIO_HSA.6 30.78,40.85 v30.78,40.82
AUXIN2_HSB_A
  Bottom 0.152: BA2.1 26.54,32.13 20.83,37.85 19.68,37.85 17.53,40 16.64,40 14.73,38.1 13.46,38.1 10.67,35.31 10.26,33.19 DIO_HSB.2
AUXIN2_HSB_B
  Bottom 0.152: BB2.1 24.64,35.56 21.21,38.99 20.07,38.99 17.91,41.15 16.26,41.15 15.24,40.13 13.84,40.13 12.95,39.24 12.95,39.12 9.55,35.74 8.89,32.35 DIO_HSB.6
AUXIN3_HSA_A  (via drill 0.3)
  Top 0.152: AA3.1 30.22,34.66 30.22,39.28 32.77,41 v33.49,40.86
  Bottom 0.152: DIO_HSA.3 33.07,40.95 v33.49,40.86
AUXIN3_HSA_B  (via drill 0.3)
  Top 0.152: AB3.1 28.96,36.7 29.21,36.96 29.21,40.39 29.22,40.38 v32.49,42.59 | v32.49,42.59
  Bottom 0.152: DIO_HSA.7 32.47,42.47 v32.49,42.59
AUXIN3_HSB_A
  Bottom 0.152: BA3.1 25.91,33.27 20.95,38.23 19.81,38.23 17.65,40.39 16.51,40.39 14.6,38.48 13.33,38.48 10.29,35.43 9.83,33.1 DIO_HSB.3
AUXIN3_HSB_B
  Bottom 0.152: BB3.1 27.43,36.7 26.8,36.07 25.78,36.07 22.35,39.5 20.07,39.5 18.03,41.53 16,41.53 14.99,40.51 13.72,40.51 12.57,39.37 12.57,39.24 9.17,35.87 8.46,32.27 DIO_HSB.7
AUXOUT_HSA_B
  Bottom 0.152: DIO_HSA.4 33.23,41.53 35.43,41.53 AOUT.1
AUXOUT_HSB_B
  Bottom 0.152: DIO_HSB.4 10.38,31.57 10.54,31.54 11.76,32.36 BOUT.1
CS+
  Top 0.152: 21.83,31.36 U7.1 22.08,31.38 R5.2 22.08,29.96 20.95,28.83 20.95,27.88 TETHER.20
CS+_HSA  (via drill 0.3)
  Top 0.152: U7.7 18.35,32.88 19.94,34.47 19.94,39.5 v20.45,40
  Bottom 0.152: DIO_HSA.12 29.1,41.14 28.07,40.45 22.54,40.45 22.1,40 v20.45,40 | v20.45,40
CS+_HSB  (via drill 0.3)
  Top 0.152: U7.10 v18.92,31.38
  Bottom 0.152: v18.92,31.38 18.92,31.1 13.86,26.04 12.1,26.05 10.82,27.96 10.34,28.05 DIO_HSB.12
CS-
  Top 0.152: 21.82,31.88 U7.2 22.6,31.88 22.86,31.62 22.86,30.37 R5.1 22.87,29.98 21.84,28.96 21.84,27.88 TETHER.19
CS-_HSA  (via drill 0.3)
  Top 0.152: U7.6 18.31,33.38 19.56,34.63 19.56,40.26 v19.81,40.51
  Bottom 0.152: DIO_HSA.11 27.78,40.77 22.35,40.77 22.1,40.51 v19.81,40.51
CS-_HSB  (via drill 0.3)
  Top 0.152: U7.9 v19.56,31.88
  Bottom 0.152: v19.56,31.88 19.56,31.22 14.09,25.66 11.95,25.69 10.65,27.63 10.07,27.74 DIO_HSB.11
GND  (via drill 0.3, 0.33, 0.51)  (2 unrouted)
  Top 0.152: v20.88,53.69 v20.88,53.7 20.88,53.31 C7.2 | R2.2 23.41,54.54 v22.96,54.99 | v28.75,53.69 v28.75,53.7 28.75,53.31 C8.2 | R3.2 31.28,54.54 v30.83,54.99 | U10.3 14.03,20.38 13.84,20.19 13.84,18.8 14.1,18.54 14.75,18.54 U10.1 | v34.67,36.96 C9.1 | v38.1,37.72 | v38.1,37.72 C13.1 | v34.04,32 34.67,32.64 C3.1
  Top 0.305: TP7.TP 20.62,52.1 20.88,52.35 v20.88,53.7 20.88,53.29 C4.2 | TP8.TP 28.49,52.1 28.75,52.35 v28.75,53.7 28.75,53.29 C5.2 | C18.2 15.48,35.79 C17.2 14.58,35.79 14.54,35.75 v13.72,35.75 | v13.84,39.37 14.71,39.37 C19.2 15.23,39.34 C20.2 | C15.2 15.48,31.34 C14.2 14.57,31.3 v13.65,31.3 | v20.57,36.83 U8.3 | v20.45,32.38 U7.3 | v20.57,41.15 U9.3 | U10.1 14.8,18.46 v14.8,17.72 | v9.91,19.94 10.77,19.94 C22.2 | U11.3 12.8,13.78 v11.37,13.78 | U4.ST U4.COM1 40,34.97 | 40,34.97 40,32.36 C1.2 v40.26,31.75 | U4.COM4 U4.COM3 U4.COM2 | U4.COM2 | U1.4 34.27,19.32 35.31,18.29 36.83,18.29 | C2.2 37.77,20.45 | C2.2 v36.96,20.45 | R1.2 36.07,21.7 v36.07,22.35 | C6.2 v39.24,21.59 | U1.8 36.83,18.29 | 36.83,18.29 U1.2 37.1,19.32 37.46,19.68 37.46,20.45 C2.2 | U6.GND 39.56,19.05 v39.24,19.05 | v37.21,14.48 U5.GND | 40,34.97 40,35.94 39.5,36.45 U4.COM2 | U4.COM2
  Top 0.61: TETHER.11 29.9,26.66 v29.65,26.42 | C21.1 8.5,29.34 L-C.1 | v28.09,42.76 28.88,41.59 C16.1
  Bottom 0.152: U2.4 | 20.89,54.1 v20.88,53.7 | U3.4 | 28.77,54.1 v28.75,53.7 | 30.42,41.81 30.99,42.19 arc90 DIO_HSA.9
  Bottom 0.305: U2.4 v22.96,54.99 | U2.8 20.88,52.8 v20.88,53.7 20.88,55 U2.2 | U3.4 v30.83,54.99 | U3.8 28.75,52.8 v28.75,53.7 28.75,55 U3.2
  Bottom 0.61: L-C.1 7.67,28.78 7.75,29.2 8.91,29.98 8.99,30.42 8.92,30.52 | v28.09,42.76 28.25,42.87 29.48,42.63 30.05,41.79 30.31,41.73 30.42,41.81
  pour Route2 (rank 2, no thermals): -1.27,-1.27 -1.27,64.77 52.07,64.77 52.07,-1.27
  pour Top (no thermals): 6.86,25.15 6.86,28.7 8,28.7 8,27.56 10.03,27.56 10.03,25.15
  pour Top (no thermals): 43.94,25.78 43.94,22.23 42.8,22.23 42.8,23.37 40.77,23.37 40.77,25.78
  pour Bottom (no thermals): 8.05,31.47 8.8,30.36 9.12,30.58 8.37,31.68
  pour Bottom (no thermals): 30.58,41.68 31.68,42.43 31.47,42.75 30.36,42
MISO1+  (via drill 0.3)
  Top 0.152: TETHER.8 27.9,23.27 31.24,26.61 31.24,28.7 30.48,29.46 26.73,29.46 25.78,30.42 25.78,34.42 25.02,35.18 25.02,37.15 v25.21,37.34
  Bottom 0.152: v25.21,37.34 25.46,37.34 26.22,38.1 28.83,38.1 DIO_HSA.18
MISO1-  (via drill 0.3)
  Top 0.152: TETHER.7 26.9,22.71 30.8,26.61 30.8,28.57 30.29,29.08 26.61,29.08 25.4,30.29 25.4,34.29 24.64,35.05 24.64,37.85 24.83,38.04 v25.21,38.04
  Bottom 0.152: v25.21,38.04 25.59,38.42 28.64,38.42 30.21,39.48 DIO_HSA.17
MISO2+  (via drill 0.3)
  Top 0.152: TETHER.10 29.9,22.66 31.11,23.88 32.2,23.88 32.83,24.51 32.83,26.35 32,27.18 32,29.02 30.73,30.29 27.05,30.29 26.54,30.8 26.54,34.67 25.78,35.43 25.78,35.94 v26.42,36.58
  Bottom 0.152: v26.42,36.58 27.3,37.46 29.34,37.46 DIO_HSA.20
MISO2-  (via drill 0.3)
  Top 0.152: TETHER.9 28.9,22.17 30.92,24.19 31.94,24.19 32.45,24.7 32.45,26.16 31.62,26.99 31.62,28.89 30.67,29.84 26.92,29.84 26.16,30.61 26.16,34.54 25.4,35.31 25.4,36.45 v26.22,37.27
  Bottom 0.152: v26.22,37.27 26.73,37.78 29.08,37.78 DIO_HSA.19
MISO3+  (via drill 0.3)
  Top 0.152: TETHER.2 21.9,22.27 20.23,23.94 19.05,23.94 17.84,25.15 17.84,26.16 14.14,29.86 12.3,30.18 v11.04,31.3
  Bottom 0.152: DIO_HSB.18 11.1,31.27 v11.04,31.3
MISO3-  (via drill 0.3)
  Top 0.152: TETHER.1 20.9,22.79 20.07,23.62 18.86,23.62 17.46,25.02 17.46,26.04 13.99,29.51 11.89,29.86 10.98,30.69 v10.42,30.86
  Bottom 0.152: DIO_HSB.17 10.91,30.75 v10.42,30.86
MISO4+  (via drill 0.3)
  Top 0.152: TETHER.14 26.9,27.22 26.35,26.67 18.32,26.67 16.7,28.29 14.45,30.54 12.9,30.76 12.36,31.35 v12.44,31.97
  Bottom 0.152: DIO_HSB.20 12.22,30.99 v12.44,31.97
MISO4-  (via drill 0.3)
  Top 0.152: TETHER.13 27.9,27.07 27.18,26.35 18.16,26.35 14.29,30.22 12.66,30.44 11.82,31.3 v11.7,31.73
  Bottom 0.152: DIO_HSB.19 11.61,31.18 v11.7,31.73
MOSI+
  Top 0.152: TETHER.16 24.9,29.58 24.64,29.84 24.64,34.04 23.88,34.8 23.88,37.97 23.37,38.48 22.48,38.48 22.08,38.88 R9.2 22.08,40.15 U9.1
MOSI+_HSA  (via drill 0.3)
  Top 0.152: U9.7 18.67,41.65 20.71,43.69 23.55,43.69 24.64,42.59 24.64,40.89 25.78,39.75 v25.78,38.99
  Bottom 0.152: v25.78,38.99 26.04,38.73 28.32,38.73 28.64,38.92 DIO_HSA.16
MOSI+_HSB  (via drill 0.3)
  Top 0.152: 16.89,40.15 U9.10 17.14,40.15 v17.14,39.05
  Bottom 0.152: 10.96,29.97 DIO_HSB.16 11.32,29.46 11.68,29.39 12.31,29.82 15.69,29.82 17.14,31.27 v17.14,39.05
MOSI-
  Top 0.152: TETHER.15 25.91,29.08 25.02,29.97 25.02,34.16 24.26,34.92 24.26,38.1 23.24,39.12 R9.1 22.86,40.36 22.57,40.65 U9.2
MOSI-_HSA  (via drill 0.3)
  Top 0.152: U9.6 18.54,42.15 20.46,44.07 23.64,44.07 25.02,42.7 25.02,41.15 26.16,40 26.16,39.62 26.54,39.24 v26.86,39.24
  Bottom 0.152: v26.86,39.24 28.38,39.24 DIO_HSA.15
MOSI-_HSB  (via drill 0.3)
  Top 0.152: U9.9 17.31,40.64 18.13,40.64 18.41,40.36 18.41,39.24 v17.65,38.48
  Bottom 0.152: DIO_HSB.15 11.07,29.12 11.68,29 12.34,29.45 15.81,29.45 17.53,31.16 17.53,38.35 v17.65,38.48
N$1
  Top 0.305: R10.2 11.28,14.99 U11.2
N$2  (via drill 0.3)
  Top 0.152: v21.6,55 21.55,54.95 C7.1 C11.1
  Bottom 0.152: U2.3 v21.6,55
N$3
  Top 0.61: R15.1 18.67,9.78 LED1+.1
  Bottom 0.61: LED1.A2 LED1.A1 22.14,9.78 18.67,9.78 LED1+.1
N$4
  Top 0.305: Q1.S 26.35,15.21 D1.A
  Top 0.406: R15.2 24.66,10.69 25.53,11.56 27.05,11.56 27.69,12.19 27.69,13.69 27.41,13.97 27.05,13.97 26.54,14.48 D1.A
N$5  (via drill 0.3)
  Top 0.152: U10.2 16.64,19.43 v19.43,22.22
  Bottom 0.152: LED_TRIG.1 33.53,39.24 32.64,38.35 32.64,35.31 32.38,35.05 32.38,34.8 32.64,34.42 32.64,30.48 31.88,29.72 26.92,29.72 v19.43,22.22
N$6
  Top 0.305: U10.4 12.48,20.38 13.21,19.66 13.21,18.05 12.81,17.65 11.91,17.65 R10.1
N$7
  Top 0.305: Q2.G R12.2 28.93,15.14 30.61,13.46 D2.C
N$8
  Top 0.152: R2.1 C11.2
N$9
  Top 0.61: R13.1 39.3,26.88 RIGHT.A2 RIGHT.A1 R-A.1
N$10  (via drill 0.3)
  Top 0.152: v29.48,55 29.43,54.95 C8.1 C12.1
  Bottom 0.152: U3.3 v29.48,55
N$11
  Top 0.305: Q2.S 30.48,15.21 D2.A
  Top 0.406: D2.A 31.75,14.07 31.75,12.19 30.86,11.3 28.19,11.3 26.52,9.63 R16.2
N$12
  Top 0.61: R16.1 32.26,9.78 LED2+.1
  Bottom 0.61: LED2.A1 LED2.A2 32.05,9.98 LED2+.1
N$13
  Top 0.61: R14.1 10.61,23.92 LEFT.A2 LEFT.A1 L-A.1
N$14
  Top 0.152: R3.1 C12.2
N$15
  Top 0.305: C6.1 37.1,21.59 C10.1 35.95,19.72 U1.3
N$16
  Top 0.305: C10.2 R1.1
N$17
  Top 0.152: U7.4 21.72,32.91 22.47,32.91 22.73,32.64 22.73,32.38 23,32.12 R4.2
N$18
  Top 0.152: U9.4 21.72,41.67 22.47,41.67 22.73,41.4 22.73,41.15 23,40.88 R7.2
N$19
  Top 0.152: U8.4 21.72,37.35 22.47,37.35 22.73,37.08 22.73,36.83 23,36.56 R6.2
N$20
  Top 0.305: Q1.G 24.45,15.26 R11.2 24.74,15.26 26.54,13.46 D1.C
N$21
  Bottom 0.152: 28.83,36.7 31.88,36.7
N$22
  Top 0.305: 23.24,14.1 23.24,17.78 27.07,17.78 27.81,17.04 27.81,14.48 28.22,14.07 R12.1 | U11.7 18.44,14.1 | 18.44,14.1 U11.6 | R11.1 24.36,14.1 23.24,14.1 | 23.24,14.1 18.44,14.1
N$24
  Bottom 0.152: 28.83,35.56 31.88,35.56
N$25
  Bottom 0.152: 28.83,34.42 31.88,34.42
N$26
  Bottom 0.152: 28.83,33.27 31.88,33.27
N$27
  Bottom 0.152: 28.83,32.13 31.88,32.13
N$28
  Bottom 0.152: 28.83,30.99 31.88,30.99
N$30
  Bottom 0.152: 36.32,40.64 36.32,39.24
OUT_GX  (via drill 0.3)
  Top 0.152: v22.92,52.75 23.19,52.72 23.49,52.42 TP2.TP
  Bottom 0.152: 23.58,52.7 U2.6 23,52.8 v22.92,52.75
OUT_GY  (via drill 0.3)
  Top 0.152: 31.36,51.95 arc90 TP4.TP 31.37,52.32 30.97,52.72 v30.8,52.75
  Bottom 0.152: v30.8,52.75 30.88,52.8 U3.6
OUTX
  Top 0.152: U5.OUT 32.77,15.11 32.77,20.57 33.66,21.46 33.66,26.16 32.77,27.05 32.77,30.1 GX.1
OUTY
  Top 0.152: U6.OUT 38.8,15.24 35.81,15.24 34.8,16.26 33.89,16.26 33.15,17 33.15,20.32 34.04,21.21 34.04,26.29 33.15,27.18 33.15,30.86 GY.1
OUTZ
  Top 0.152: U1.6 33.53,17.74 33.53,20.07 34.42,20.95 34.42,26.42 33.53,27.3 33.53,31.72 31.98,33.27 GZ.1
REFX
  Top 0.305: RX.1 35.18,14.67 U5.REF
REFY
  Top 0.305: U6.REF 39.31,17.65 RY.1
SCLK+
  Top 0.152: TETHER.18 22.9,29 23.88,29.97 23.88,33.53 23.49,33.91 22.35,33.91 22.1,34.16 22.1,34.78 R8.2 22.08,35.83 U8.1
SCLK+_HSA  (via drill 0.3)
  Top 0.152: U8.7 18.28,37.33 19.18,38.23 19.18,41.04 21.06,42.93 23.34,42.93 23.88,42.39 23.88,39.62 v24.26,39.24
  Bottom 0.152: DIO_HSA.14 29.54,40.51 28.51,39.81 25.78,39.81 25.21,39.24 v24.26,39.24
SCLK+_HSB  (via drill 0.3)
  Top 0.152: U8.10 17.31,35.81 18.03,35.81 v18.03,35.05
  Bottom 0.152: v18.03,35.05 17.91,34.92 17.91,31.06 15.93,29.08 12.36,29.08 11.7,28.63 10.8,28.81 DIO_HSB.14
SCLK-
  Top 0.152: TETHER.17 23.88,27.85 23.88,29.46 24.26,29.84 24.26,33.66 23.62,34.29 22.99,34.29 22.87,34.4 R8.1 22.86,36.04 22.57,36.33 U8.2
SCLK-_HSA  (via drill 0.3)
  Top 0.152: U8.6 18.02,37.83 18.8,38.61 18.8,41.19 20.91,43.31 23.44,43.31 24.26,42.49 24.26,40.26 v24.76,39.75
  Bottom 0.152: v24.76,39.75 25.21,39.75 25.59,40.13 28.32,40.13 29.32,40.81 DIO_HSA.13
SCLK-_HSB  (via drill 0.3)
  Top 0.152: U8.9 18.18,36.33 18.54,35.96 v18.54,34.54
  Bottom 0.152: v18.54,34.54 18.29,34.29 18.29,30.95 16.05,28.71 12.39,28.71 11.66,28.22 10.57,28.43 DIO_HSB.13
VCC  (via drill 0.3, 0.33, 0.51)  (2 unrouted)
  Top 0.152: R7.1 23.24,42.04 v22.99,42.29 21.84,42.29 U9.5 | R6.1 23.24,37.72 v22.99,37.97 21.84,37.97 U8.5 | v21.46,34.04 21.7,33.8 U7.5 22.76,33.38 R4.1
  Top 0.305: v20.17,54.93 20.14,54.93 C4.1 19.89,54.08 19.53,53.71 19.53,52.04 TP1.TP | C5.1 28.02,54.93 v28.05,54.93 | C5.1 27.77,54.08 | TP3.TP 27.3,53.74 27.65,54.08 C5.1 | U8.8 17.29,36.84 C18.1 15.73,36.85 C17.1 14.58,36.85 14.54,36.89 v13.72,36.89 | U9.8 16.24,41.15 C20.1 15.1,40.78 C19.1 | C19.1 14.71,40.39 | U7.8 17.29,32.4 C15.1 15.73,32.41 C14.1 14.5,32.51 v13.65,32.51 | v9.91,18.86 10.76,18.86 C22.1 11.69,18.9 U10.5 | v14.6,41.15 14.6,40.54 arc90 C19.1 | v37.34,31.37 37.97,31.37 C1.1 37.77,32.31 U4.VS2 U4.VS1 | v39.24,20.45 | v39.24,20.45 C2.1 38.49,19.32 U1.1 U1.10 U1.9 | U6.VCC 39.94,20.45 v39.24,20.45 | v38.23,14.48 | v38.23,14.48 U5.VCC
  Top 0.61: R14.3 13.39,22.53 R14.2 14.79,23.94 v16.07,23.94 | R13.3 36.9,28.65 R13.2 35.63,26.09 v35.94,25.78 | TETHER.12 28.9,26.8 v28.26,26.16 | C21.2 7.65,31.69 v7.76,32.24 | v29.77,43.9 C16.2
  Bottom 0.305: v20.17,54.93 20.17,55 U2.1 U2.10 U2.9 | v28.05,54.93 28.05,55 U3.1 U3.10 U3.9
  pour Route15 (rank 2, no thermals): -1.9,-1.9 -1.9,65.4 52.7,65.4 52.7,-1.91
  pour Bottom (no thermals): 7.7,31.31 8.34,30.36 8.03,30.15 7.1,31.52 7.26,32.31 7.78,32.67 8.14,32.14 7.67,31.82 7.6,31.47
  pour Bottom (no thermals): 30.42,42.49 29.53,43.81 30,44.13 30.53,43.34 31.15,43.22 31.26,43.06
VDD  (via drill 0.51)
  Top 0.61: Q1.D v26.54,18.8 | v26.54,18.8 | Q2.D v30.61,18.8 | v30.61,18.8
  other vias: 19.05,17.4 23.5,20.07
  pour Route15 (isolate 0.254): 38.35,4.06 15.87,4.06 15.87,16.51 17.15,17.78 21.59,17.78 22.86,19.05 22.86,22.23 26.04,22.23 26.04,19.56 31.18,19.56 32,18.73 32,12.95 33.27,11.68 38.35,11.68
  pour Top (no thermals): 17.53,15.88 19.23,15.88 19.69,15.42 19.69,14.73 22.23,14.73 22.23,16.26 20.68,16.26 20.32,16.62 20.32,17.65 17.53,17.65
  pour Top (no thermals): 22.86,22.23 22.86,19.69 24.13,19.69 24.13,22.23
VREF_GX  (via drill 0.3)
  Top 0.152: v21.53,52.19 21.77,51.94 TP5.TP
  Bottom 0.152: U2.7 21.75,52.8 21.53,52.58 v21.53,52.19
VREF_GY  (via drill 0.3)
  Top 0.152: TP6.TP 29.65,51.94 v29.4,52.19
  Bottom 0.152: U3.7 29.62,52.8 29.4,52.58 v29.4,52.19
VREFZ
  Top 0.305: U1.7 35.56,16.7 RZ.1
VSS  (via drill 0.51)
  Top 0.61: C23.1 v22.1,17.14 | C24.2 v20.95,10.79
  other vias: 25.4,20.07
  pour Route2 (isolate 0.254): 38.35,4.45 15.87,4.45 15.89,16.51 17.14,17.78 21.59,17.78 22.86,19.05 22.86,22.22 26.04,22.23 26.03,19.56 31.18,19.56 32,18.73 32,12.95 33.27,11.68 38.35,11.68
  pour Top (no thermals): 24.77,22.23 24.77,19.69 26.03,19.69 26.04,22.23
  pour Top (no thermals): 17.53,12.7 17.53,11.43 21.97,11.43 21.97,12.83 17.53,12.83
  pour Bottom (no thermals): 19.3,8.51 24.89,8.51 24.89,6.48 19.3,6.48
  pour Bottom (no thermals): 25.91,8.51 31.5,8.51 31.5,6.48 25.91,6.48
XOUT1
  Top 0.152: U4.XOUT 34.74,33.72 C3.2 34.05,34.42 AX.1
YOUT1
  Top 0.152: U4.YOUT 34.82,35.02 C9.2 32.27,35.17 AY.1
ZOUT1
  Top 0.152: U4.ZOUT 36.52,37.67 C13.2 32.89,37.72 AZ.1

### Text on the board
tPlace: 256 Channel / SPI Interface / with IMU and T1M / Rev 1.0 | CC BY-SA-NC-4.0 / JPN, MWL@MIT / 2016 | GND | LED | BAUX | AAUX | IMU | TRIG | B3 | B2 | GND | B1 | A3 | A2 | VCC | A1 | GND | VCC | VSS | GND | VDD
bPlace: LED / TRIG / to / AOUT | Cut to separate / IMU from / HSA AUX IN | 256 Channel SPI / Interface / Rev. 1.0 | CC BY-SA-NC-4.0 / JPN, MWL@MIT / 2016